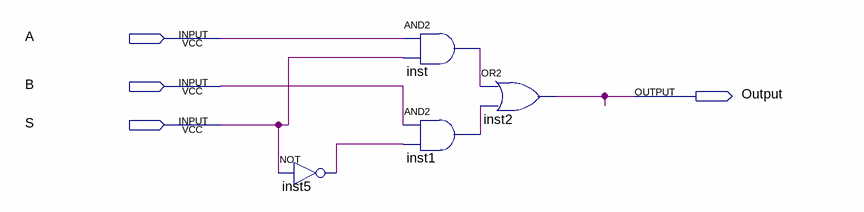
[diagram p0: schematic sheet]
// Quartus schematic start.bdf as structural Verilog: 4 symbols, 4 pins
module start (
  input  A,
  input  B,
  input  S,
  output Output
);

  wire inst1_out, inst5_out, inst_out;

  not inst5 (inst5_out, S);
  and inst (inst_out, A, S);
  and inst1 (inst1_out, B, inst5_out);
  or inst2 (Output, inst_out, inst1_out);
endmodule
